# EAGLE schematic WizFi250_EVB_SCH_V100 (EAGLE 6.4)
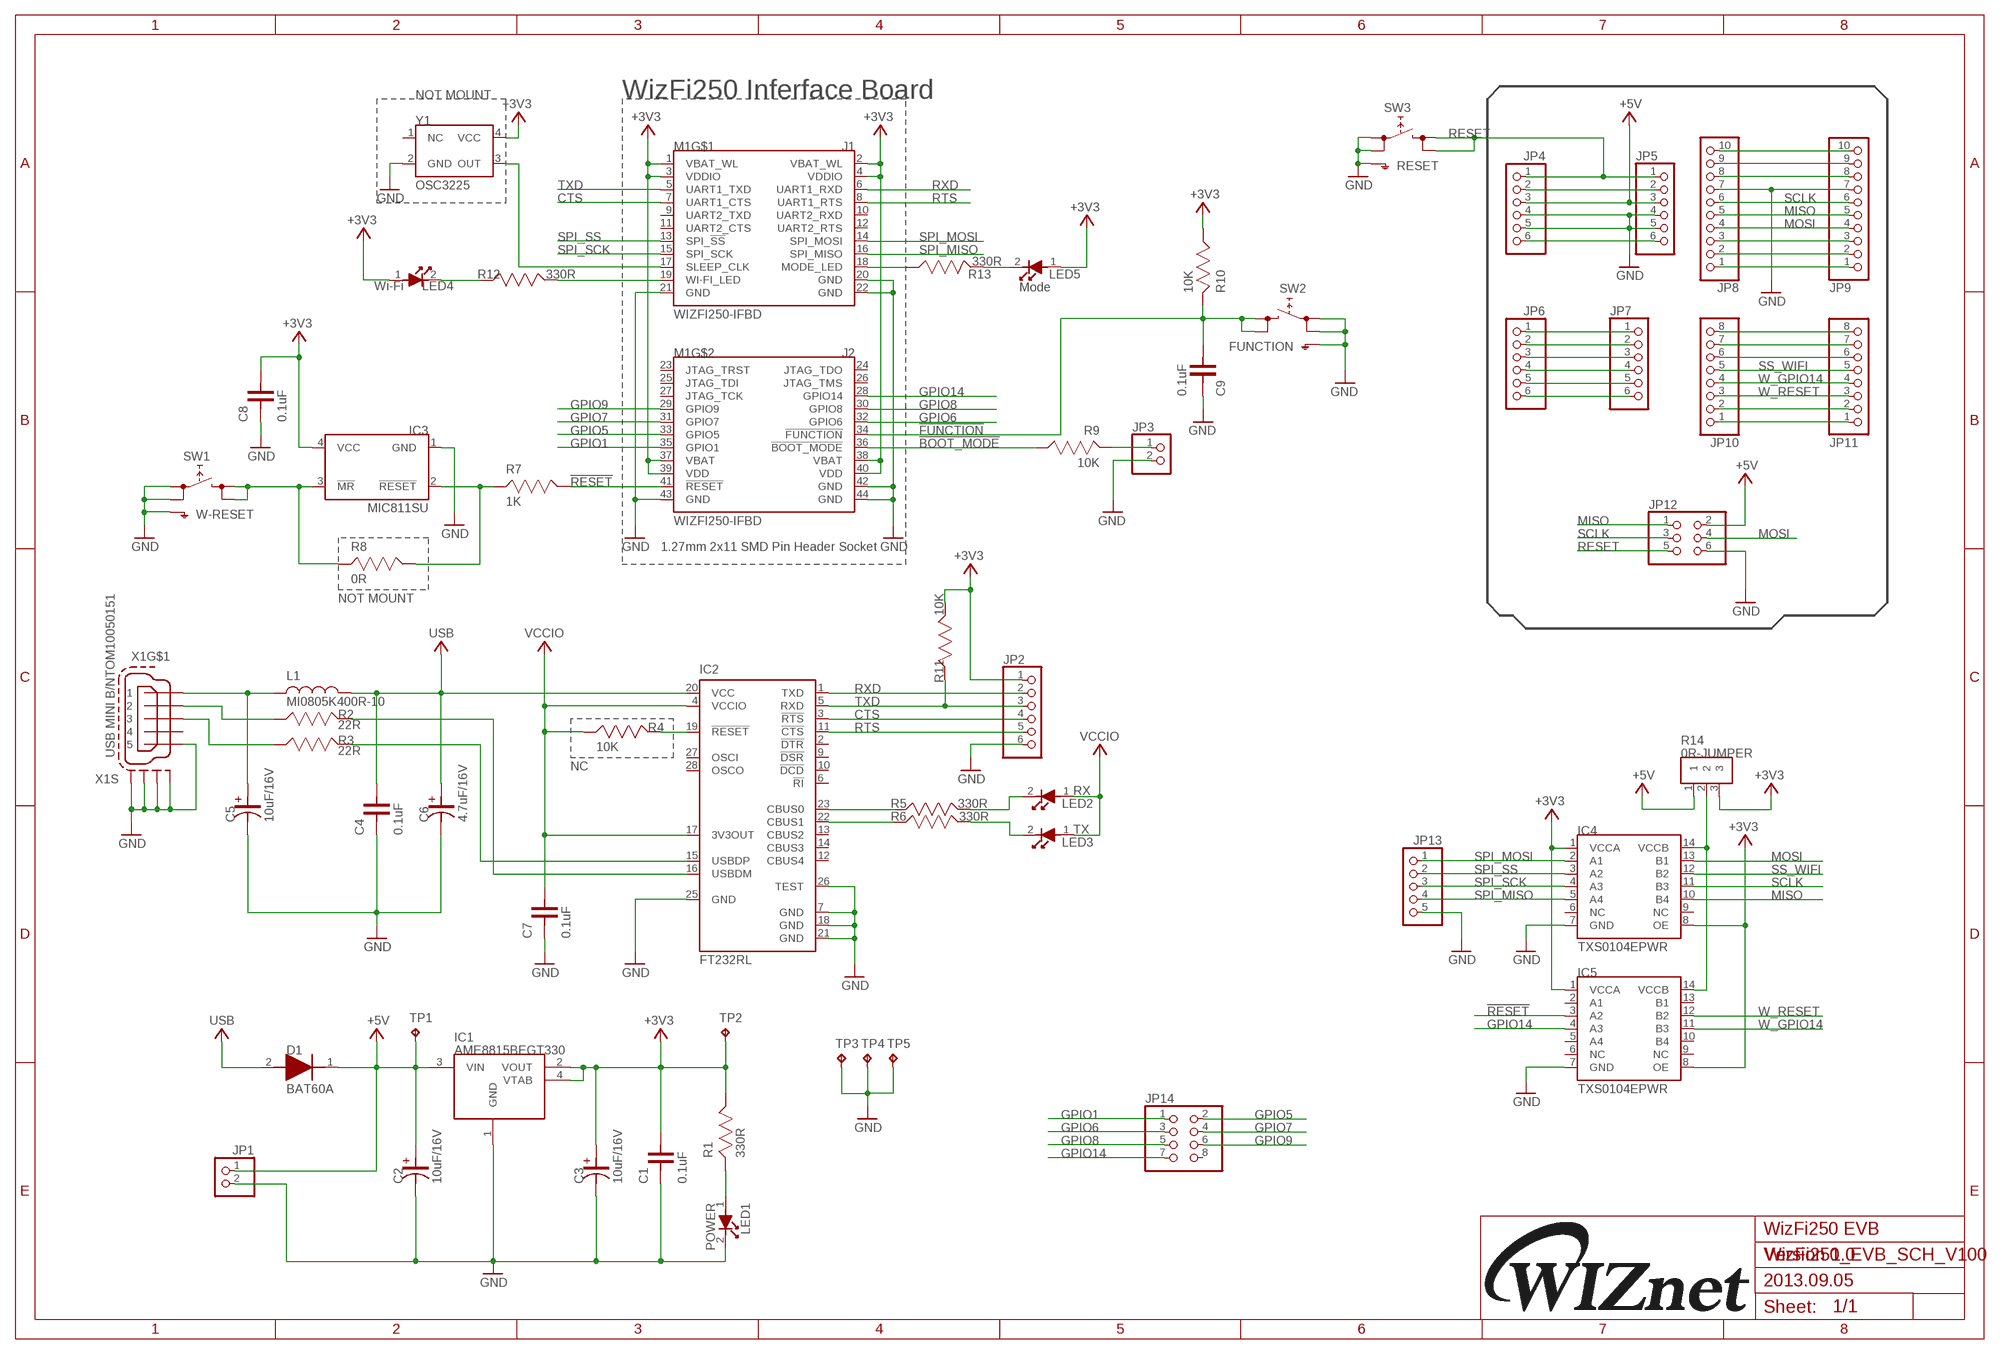
[diagram p0: schematic, sheet 1]

## Parts
C1  0.1uF  C-1608  [C-1608]
C2  10uF/16V  C-3216(TANTAL)  [C-3216(TANTAL)]
C3  10uF/16V  C-3216(TANTAL)  [C-3216(TANTAL)]
C4  0.1uF  C-1608  [C-1608]
C5  10uF/16V  C-3216(TANTAL)  [C-3216(TANTAL)]
C6  4.7uF/16V  C-3216(TANTAL)  [C-3216(TANTAL)]
C7  0.1uF  C-1608  [C-1608]
C8  0.1uF  C-1608  [C-1608]
C9  0.1uF  C-1608  [C-1608]
D1  BAT60A  [BAT60A]
IC1  AME8815BEGT330  [SOT-223]
IC2  FT232RL  [SSOP28]
IC3  MIC811SU  [MIC811SU]
IC4  TXS0104EPWR  [TXS0104EPWR]
IC5  TXS0104EPWR  [TXS0104EPWR]
JP1  PINHD-1X2  [1X02]
JP2  PINHD-1X6  [1X06]
JP3  PINHD-1X2  [1X02]
JP4  PINHD-1X6  [1X06]
JP5  PINHD-1X6  [1X06]
JP6  PINHD-1X6  [1X06]
JP7  PINHD-1X6  [1X06]
JP8  PINHD-1X10  [1X10]
JP9  PINHD-1X10  [1X10]
JP10  PINHD-1X8  [1X08]
JP11  PINHD-1X8  [1X08]
JP12  PINHD-2X3  [2X03]
JP13  PINHD-1X5  [1X05]
JP14  PINHD-2X4  [2X04]
L1  MI0805K400R-10  L-2012  [L-2012]
LED1  POWER  LED-1608  [LED-1608]
LED2  RX  LED-1608  [LED-1608]
LED3  TX  LED-1608  [LED-1608]
LED4  Wi-Fi  LED-1608  [LED-1608]
LED5  Mode  LED-1608  [LED-1608]
M1  WIZFI250-IFBD  [WIZFI250-IFBD]
R1  330R  R-1608  [R-1608]
R2  22R  R-1608  [R-1608]
R3  22R  R-1608  [R-1608]
R4  10K  R-1608  [R-1608]
R5  330R  R-1608  [R-1608]
R6  330R  R-1608  [R-1608]
R7  1K  R-1608  [R-1608]
R8  0R  R-1608  [R-1608]
R9  10K  R-1608  [R-1608]
R10  10K  R-1608  [R-1608]
R11  10K  R-1608  [R-1608]
R12  330R  R-1608  [R-1608]
R13  330R  R-1608  [R-1608]
R14  0R-JUMPER  R-1608-JUMPER  [R-1608-JUMPER]
SW1  W-RESET  SKHMPSE010  [SKHMPXE010]
SW2  FUNCTION  SKHMPSE010  [SKHMPXE010]
SW3  RESET  SKHMPSE010  [SKHMPXE010]
TP1  TPB1,27  [B1,27]
TP2  TPB1,27  [B1,27]
TP3  TPB1,27  [B1,27]
TP4  TPB1,27  [B1,27]
TP5  TPB1,27  [B1,27]
X1  USB MINI B/NTOM10050151  MINI-USB-SCHIELD-32005-201  [32005-201]
Y1  OSC3225  [OSC3225]

## Nets
!BOOT_MODE: M1.36(!BOOT_MODE) R9.2
!FUNCTION: C9.2 M1.34(!FUNCTION) R10.1 SW2.3(2.1) SW2.4(2.2)
!RESET: IC5.3(A2) M1.41(!RESET) R7.2
+3V3: C1.2 C3.1 C8.2 IC1.2(VOUT) IC1.4(VTAB) IC3.4(VCC) IC4.1(VCCA) IC4.8(OE) IC5.1(VCCA) IC5.8(OE) JP2.1 LED4.1 LED5.1 M1.1(VBAT_WL) M1.2(VBAT_WL) M1.3(VDDIO) M1.4(VDDIO) M1.37(VBAT) M1.38(VBAT) M1.39(VDD) M1.40(VDD) R1.2 R10.2 R11.2 R14.3 TP2.TP Y1.4(VCC)
+5V: C2.1 D1.1 IC1.3(VIN) JP1.1 JP4.3 JP5.3 JP12.2 R14.1 TP1.TP
CTS: IC2.3(!RTS) JP2.4 M1.7(UART1_CTS)
GND: C1.1 C2.2 C3.2 C4.1 C5.2 C6.2 C7.1 C8.1 C9.1 IC1.1(GND) IC2.7(GND) IC2.18(GND) IC2.21(GND) IC2.25(GND) IC2.26(TEST) IC3.1(GND) IC4.7(GND) IC5.7(GND) JP1.2 JP2.6 JP3.2 JP4.4 JP4.5 JP5.4 JP5.5 JP8.7 JP9.7 JP12.6 JP13.5 LED1.2 M1.20(GND) M1.21(GND) M1.22(GND) M1.42(GND) M1.43(GND) M1.44(GND) SW1.1(1.1) SW1.2(1.2) SW1.5(SH) SW2.1(1.1) SW2.2(1.2) SW2.5(SH) SW3.1(1.1) SW3.2(1.2) SW3.5(SH) TP3.TP TP4.TP TP5.TP X1.5 X1.M1(S:S1) X1.M2(S:S2) X1.M3(S:S3) X1.M4(S:S4) Y1.2(GND)
GPIO1: JP14.1 M1.35(GPIO1)
GPIO5: JP14.2 M1.33(GPIO5)
GPIO6: JP14.3 M1.32(GPIO6)
GPIO7: JP14.4 M1.31(GPIO7)
GPIO8: JP14.5 M1.30(GPIO8)
GPIO9: JP14.6 M1.29(GPIO9)
GPIO14: IC5.4(A3) JP14.7 M1.28(GPIO14)
MISO: IC4.10(B4) JP8.5 JP9.5 JP12.1
MOSI: IC4.13(B1) JP8.4 JP9.4 JP12.4
N$1: IC4.14(VCCB) IC5.14(VCCB) R14.2
N$2: R2.1 X1.2
N$3: R3.1 X1.3
N$4: LED1.1 R1.1
N$5: JP3.1 R9.1
N$6: IC2.16(USBDM) R2.2
N$7: IC2.15(USBDP) R3.2
N$8: IC2.19(!RESET) R4.2
N$9: IC3.2(!RESET) R7.1 R8.2
N$16: LED2.2 R5.2
N$17: LED3.2 R6.2
N$18: JP4.2 JP5.2
N$22: JP4.6 JP5.6
N$23: JP6.1 JP7.1
N$24: JP6.2 JP7.2
N$25: JP6.3 JP7.3
N$26: JP6.4 JP7.4
N$27: JP6.5 JP7.5
N$28: JP6.6 JP7.6
N$29: JP8.10 JP9.10
N$30: JP8.9 JP9.9
N$31: JP8.8 JP9.8
N$36: JP8.3 JP9.3
N$37: JP8.2 JP9.2
N$38: JP8.1 JP9.1
N$39: JP10.8 JP11.8
N$40: JP10.7 JP11.7
N$41: JP10.6 JP11.6
N$45: JP10.2 JP11.2
N$46: JP10.1 JP11.1
N$50: M1.17(SLEEP_CLK) Y1.3(OUT)
N$51: M1.19(WI-FI_LED) R12.2
N$52: LED4.2 R12.1
N$64: M1.18(MODE_LED) R13.1
N$65: LED5.2 R13.2
RESET: JP4.1 JP5.1 JP12.5 SW3.3(2.1) SW3.4(2.2)
RTS: IC2.11(!CTS) JP2.5 M1.8(UART1_RTS)
RX-LED: IC2.23(CBUS0) R5.1
RXD: IC2.1(TXD) JP2.2 M1.6(UART1_RXD)
SCLK: IC4.11(B3) JP8.6 JP9.6 JP12.3
SPI_MISO: IC4.5(A4) JP13.4 M1.16(SPI_MISO)
SPI_MOSI: IC4.2(A1) JP13.1 M1.14(SPI_MOSI)
SPI_SCK: IC4.4(A3) JP13.3 M1.15(SPI_SCK)
SPI_SS: IC4.3(A2) JP13.2 M1.13(SPI_!SS)
SS_WIFI: IC4.12(B2) JP10.5 JP11.5
TX-LED: IC2.22(CBUS1) R6.1
TXD: IC2.5(RXD) JP2.3 M1.5(UART1_TXD) R11.1
USB: C4.2 C6.1 D1.2 IC2.20(VCC) L1.2
VCC: C5.1 L1.1 X1.1
VCCIO: C7.2 IC2.4(VCCIO) IC2.17(3V3OUT) LED2.1 LED3.1 R4.1
W_GPIO14: IC5.11(B3) JP10.4 JP11.4
W_RESET: IC5.12(B2) JP10.3 JP11.3
WI-FI_RST: IC3.3(!MR) R8.1 SW1.3(2.1) SW1.4(2.2)
Unconnected: IC2.2(!DTR) IC2.6(!RI) IC2.9(!DSR) IC2.10(!DCD) IC2.12(CBUS4) IC2.13(CBUS2) IC2.14(CBUS3) IC2.27(OSCI) IC2.28(OSCO) IC4.6(NC) IC4.9(NC) IC5.2(A1) IC5.5(A4) IC5.6(NC) IC5.9(NC) IC5.10(B4) IC5.13(B1) JP14.8 M1.9(UART2_TXD) M1.10(UART2_RXD) M1.11(UART2_CTS) M1.12(UART2_RTS) M1.23(JTAG_TRST) M1.24(JTAG_TDO) M1.25(JTAG_TDI) M1.26(JTAG_TMS) M1.27(JTAG_TCK) X1.4 Y1.1(NC)

## Notes on the sheet
- NOT MOUNT | WizFi250 Inferface Board
- J1
- J2
- 1.27mm 2x11 SMD Pin Header Socket
- NOT MOUNT
- NC
- WizFi250 EVB
- Version 1.0
- 2013.09.05

## Library data of the parts
C1 C4 C7-C9 = CAP:C-1608
C2 C3 C5 C6 = CAP:C-3216(TANTAL)
D1 = DIODE:BAT60A
IC1 = RECULATOR:AME8815BEGT330
IC2 = ftdichip:FT232R: Source: http://www.ftdichip.com/Documents/DataSheets/DS_FT232R_v104.pdf; MPN: FT232RL; OC_FARNELL: 1146032; OC_NEWARK: 91K9918
IC3 = IC:MIC811SU
IC4 IC5 = IC:TXS0104EPWR
JP1 JP3 = pinhead:PINHD-1X2: PIN HEADER
JP2 JP4-JP7 = pinhead:PINHD-1X6: PIN HEADER
JP8 JP9 = pinhead:PINHD-1X10: PIN HEADER
JP10 JP11 = pinhead:PINHD-1X8: PIN HEADER
JP12 = pinhead:PINHD-2X3: PIN HEADER
JP13 = pinhead:PINHD-1X5: PIN HEADER
JP14 = pinhead:PINHD-2X4: PIN HEADER
L1 = INDUCTOR:L-2012
LED1-LED5 = DIODE:LED-1608
M1 = WIZnet:WIZFI250-IFBD
R1-R13 = RESISTOR:R-1608
R14 = RESISTOR:R-1608-JUMPER
SW1-SW3 = switch:SKHMP*E010: 6.2 X 6.5mm TACT Switch (SMD) Source: http://www3.alps.co.jp/WebObjects/catalog.woa/PDF/E/Switch/Tact/SKHM/SKHM.PDF
TP1-TP5 = testpad:TP: Test pad
X1 = USB:MINI-USB-SCHIELD-: MINI USB-B Conector Source: www.cypressindustries.com; OC_FARNELL: unknown; OC_NEWARK: unknown
Y1 = X-TAL:OSC3225